# Altium schematic sheet Filter_Low Pass.SchDoc
size 63 x 25 mm
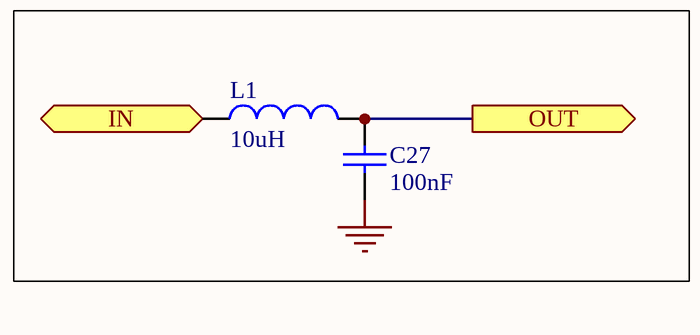
[diagram p0: Filter_Low Pass.SchDoc]

## Parts
C27  100nF  [0805]
L1  10uH  [0805]

## Ports
IN (in), OUT (out)

## Nets
GND: C27.1
IN: L1.1 ; port IN
OUT: C27.2 L1.2 ; port OUT

## Library data of the parts
C27 = Cap: Capacitor; Manufacturer: Generic Components; Class I: Passive; Published: 8-Jun-2000; Revision: July-2002: Re-released for DXP Platform.; Publisher: Altium Limited; Class II: Capacitor
L1 = Inductor: Revision: July-2002: Re-released for DXP Platform.